# Altium schematic sheet FPGA-2.SchDoc
size A3; Date: Date; CompanyName: HESSO; Engineer: Name; Address1: Route du Rawyl 47; Address2: 1950 Sion; Address3: Switzerland; ProjectName: Project Name
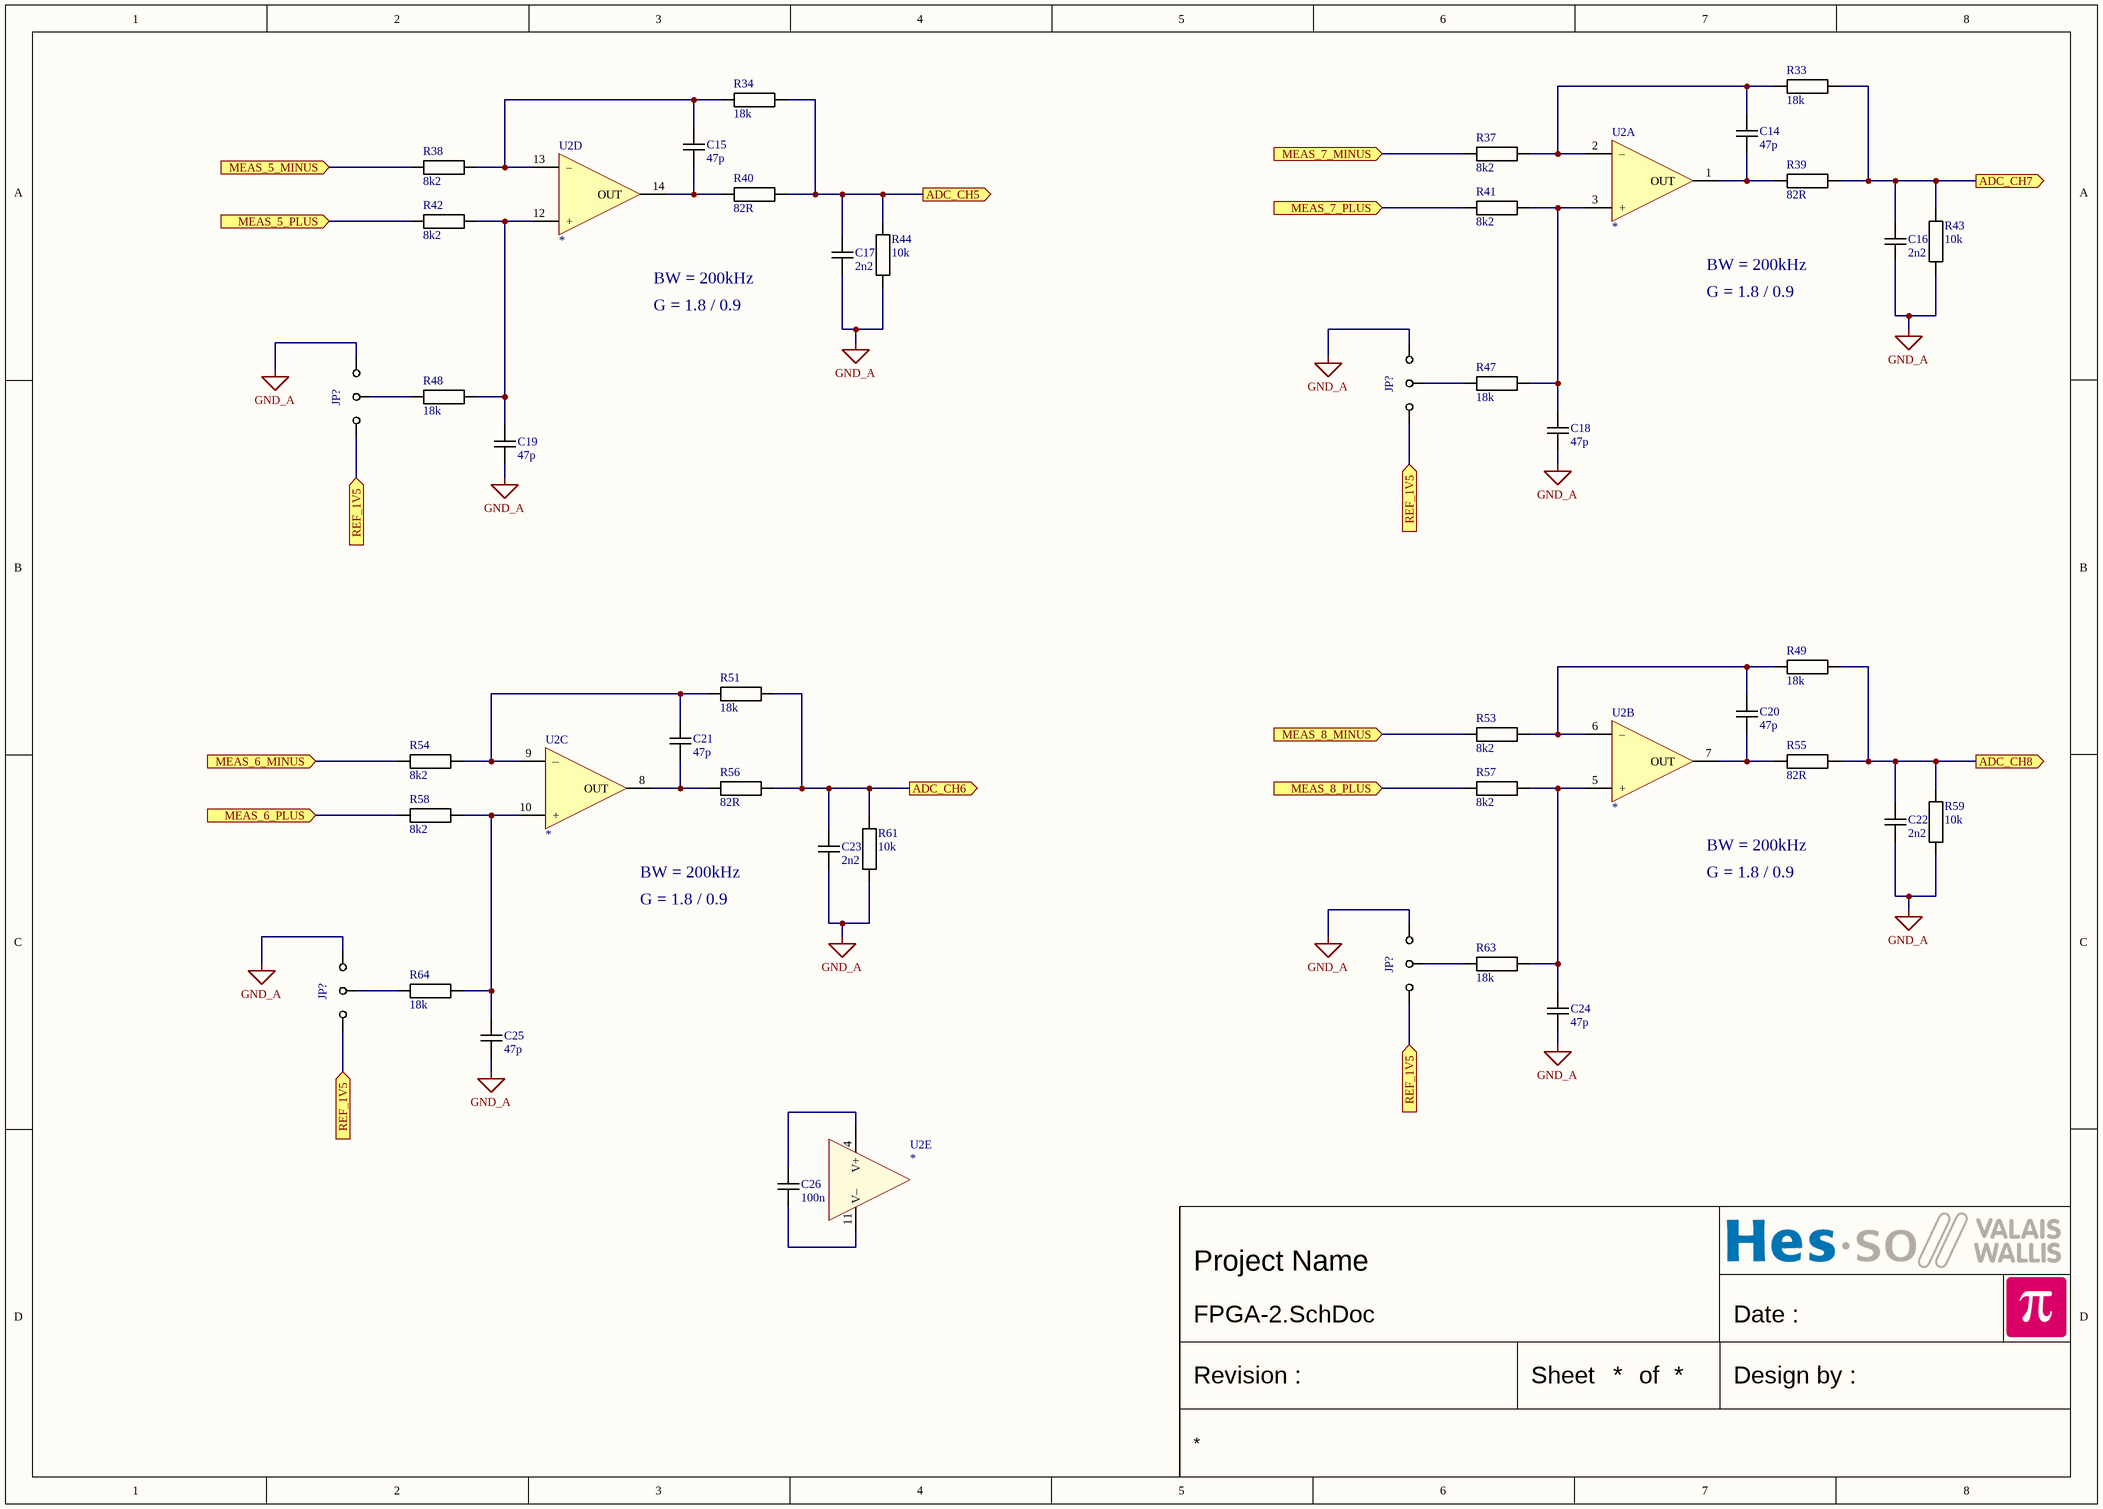
[diagram p0: FPGA-2.SchDoc]

## Parts
(Parts that share a designator on the sheet are numbered #1, #2 ... from top to bottom, then left to right.)
C14  47p  [CAPACITOR 1608 REFLOW]
C15  47p  [CAPACITOR 1608 REFLOW]
C16  2n2  [CAPACITOR 1608 REFLOW]
C17  2n2  [CAPACITOR 1608 REFLOW]
C18  47p  [CAPACITOR 1608 REFLOW]
C19  47p  [CAPACITOR 1608 REFLOW]
C20  47p  [CAPACITOR 1608 REFLOW]
C21  47p  [CAPACITOR 1608 REFLOW]
C22  2n2  [CAPACITOR 1608 REFLOW]
C23  2n2  [CAPACITOR 1608 REFLOW]
C24  47p  [CAPACITOR 1608 REFLOW]
C25  47p  [CAPACITOR 1608 REFLOW]
C26  100n  [CAPACITOR 1608 REFLOW]
JP?#1  {Value}  [JUMPER3 SMD 1608]  (value not drawn)
JP?#2  {Value}  [JUMPER3 SMD 1608]  (value not drawn)
JP?#3  {Value}  [JUMPER3 SMD 1608]  (value not drawn)
JP?#4  {Value}  [JUMPER3 SMD 1608]  (value not drawn)
R33  18k  [RESISTOR 1608 REFLOW]
R34  18k  [RESISTOR 1608 REFLOW]
R37  8k2  [RESISTOR 1608 REFLOW]
R38  8k2  [RESISTOR 1608 REFLOW]
R39  82R  [RESISTOR 1608 REFLOW]
R40  82R  [RESISTOR 1608 REFLOW]
R41  8k2  [RESISTOR 1608 REFLOW]
R42  8k2  [RESISTOR 1608 REFLOW]
R43  10k  [RESISTOR 1608 REFLOW]
R44  10k  [RESISTOR 1608 REFLOW]
R47  18k  [RESISTOR 1608 REFLOW]
R48  18k  [RESISTOR 1608 REFLOW]
R49  18k  [RESISTOR 1608 REFLOW]
R51  18k  [RESISTOR 1608 REFLOW]
R53  8k2  [RESISTOR 1608 REFLOW]
R54  8k2  [RESISTOR 1608 REFLOW]
R55  82R  [RESISTOR 1608 REFLOW]
R56  82R  [RESISTOR 1608 REFLOW]
R57  8k2  [RESISTOR 1608 REFLOW]
R58  8k2  [RESISTOR 1608 REFLOW]
R59  10k  [RESISTOR 1608 REFLOW]
R61  10k  [RESISTOR 1608 REFLOW]
R63  18k  [RESISTOR 1608 REFLOW]
R64  18k  [RESISTOR 1608 REFLOW]
U2  *  [SO14 P1.27 C4.0X8.8 H1.75]  (parts A,B,C,D,E of 5)

## Ports
ADC_CH5 (out), ADC_CH6 (out), ADC_CH7 (out), ADC_CH8 (out), MEAS_5_MINUS (in), MEAS_5_PLUS (in), MEAS_6_MINUS (in), MEAS_6_PLUS (in), MEAS_7_MINUS (in), MEAS_7_PLUS (in), MEAS_8_MINUS (in), MEAS_8_PLUS (in), REF_1V5 (in)

## Nets
GND_A: C16.1 C17.1 C18.1 C19.1 C22.1 C23.1 C24.1 C25.1 JP?#1.3 JP?#2.3 JP?#3.3 JP?#4.3 R43.2 R44.2 R59.2 R61.2
ADC_CH5: C17.2 R34.2 R40.2 R44.1 ; port ADC_CH5
ADC_CH6: C23.2 R51.2 R56.2 R61.1 ; port ADC_CH6
ADC_CH7: C16.2 R33.2 R39.2 R43.1 ; port ADC_CH7
ADC_CH8: C22.2 R49.2 R55.2 R59.1 ; port ADC_CH8
MEAS_5_MINUS: R38.1 ; port MEAS_5_MINUS
MEAS_5_PLUS: R42.1 ; port MEAS_5_PLUS
MEAS_6_MINUS: R54.1 ; port MEAS_6_MINUS
MEAS_6_PLUS: R58.1 ; port MEAS_6_PLUS
MEAS_7_MINUS: R37.1 ; port MEAS_7_MINUS
MEAS_7_PLUS: R41.1 ; port MEAS_7_PLUS
MEAS_8_MINUS: R53.1 ; port MEAS_8_MINUS
MEAS_8_PLUS: R57.1 ; port MEAS_8_PLUS
REF_1V5: JP?#1.1 JP?#2.1 JP?#3.1 JP?#4.1 ; port REF_1V5
NetC14_1: C14.1 R39.1 U2.1(OUT)
NetC14_2: C14.2 R33.1 R37.2 U2.2(–)
NetC15_1: C15.1 R40.1 U2.14(OUT)
NetC15_2: C15.2 R34.1 R38.2 U2.13(–)
NetC18_2: C18.2 R41.2 R47.1 U2.3(+)
NetC19_2: C19.2 R42.2 R48.1 U2.12(+)
NetC20_1: C20.1 R55.1 U2.7(OUT)
NetC20_2: C20.2 R49.1 R53.2 U2.6(–)
NetC21_1: C21.1 R56.1 U2.8(OUT)
NetC21_2: C21.2 R51.1 R54.2 U2.9(–)
NetC24_2: C24.2 R57.2 R63.1 U2.5(+)
NetC25_2: C25.2 R58.2 R64.1 U2.10(+)
NetC26_1: C26.1 U2.11(V–)
NetC26_2: C26.2 U2.4(V+)
NetJP?#1_2: JP?#1.2 R47.2
NetJP?#2_2: JP?#2.2 R48.2
NetJP?#3_2: JP?#3.2 R63.2
NetJP?#4_2: JP?#4.2 R64.2

## Notes on the sheet
- BW = 200kHz
- G = 1.8 / 0.9
- Date :
- Revision :
- Sheet
- of
- Design by :

## Library data of the parts
C14-C26 = Capacitor: Capacitor X7R 10% 50V 1608(0603)
  C14 C15 C18-C21 C24 C25: Value: 47p
  C16 C17 C22 C23: Value: 2n2
  C26: Value: 100n
JP?#1-JP?#4 = JUMPER 3 POS: Value: {Value}
R33 R34 R37-R44 R47-R49 R51 R53-R59 R61 R63 R64 = Resistor: Resistor 1% 50V 100mW 1608(0603)
  R33 R34 R47-R49 R51 R63 R64: Value: 18k
  R37 R38 R41 R42 R53 R54 R57 R58: Value: 8k2
  R39 R40 R55 R56: Value: 82R
  R43 R44 R59 R61: Value: 10k
U2 = OPA QUAD: Generic quad OPA 14 pins; Value: *